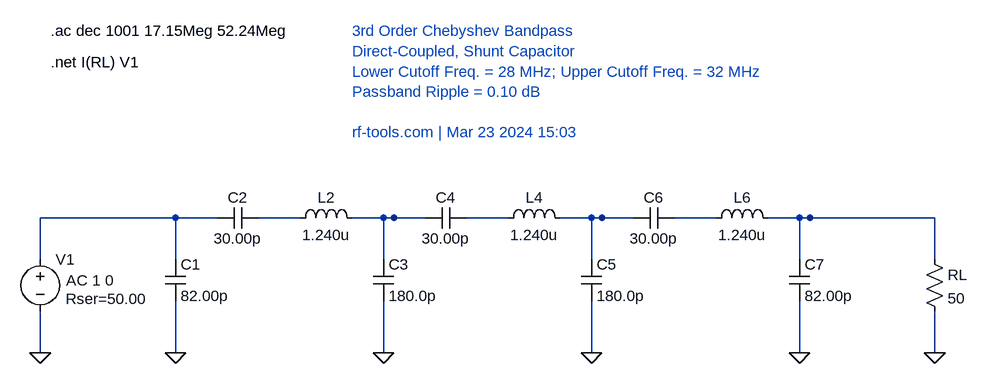
[diagram p0: schematic 10m.asc]
10m.asc, the LTspice schematic file:
Version 4
SHEET 1 1200 400
WIRE 0 0 0 64
WIRE 0 144 0 208
WIRE 0 0 208 0
WIRE 208 0 208 64
WIRE 208 128 208 208
WIRE 208 0 272 0
WIRE 336 0 400 0
WIRE 480 0 544 0
WIRE 528 0 528 64
WIRE 528 128 528 208
WIRE 528 0 592 0
WIRE 656 0 720 0
WIRE 800 0 864 0
WIRE 848 0 848 64
WIRE 848 128 848 208
WIRE 848 0 912 0
WIRE 976 0 1040 0
WIRE 1120 0 1184 0
WIRE 1168 0 1168 64
WIRE 1168 128 1168 208
WIRE 1168 0 1376 0
WIRE 1376 0 1376 64
WIRE 1376 144 1376 208
FLAG 0 208 0
FLAG 208 208 0
FLAG 528 208 0
FLAG 848 208 0
FLAG 1168 208 0
FLAG 1376 208 0
SYMBOL voltage 0 48 R0
WINDOW 123 40 48 Left 2
WINDOW 39 39 77 Left 2
SYMATTR InstName V1
SYMATTR Value ""
SYMATTR Value2 AC 1 0
SYMATTR SpiceLine Rser=50.00
SYMBOL cap 192 64 R0
SYMATTR InstName C1
SYMATTR Value 82.00p
SYMBOL cap 272 16 R270
SYMATTR InstName C2
SYMATTR Value 30.00p
WINDOW 0 32 32 VTop 2
WINDOW 3 0 32 VBottom 2
SYMBOL ind 384 16 R270
SYMATTR InstName L2
SYMATTR Value 1.240u
WINDOW 0 32 56 VTop 2
WINDOW 3 5 56 VBottom 2
SYMBOL cap 512 64 R0
SYMATTR InstName C3
SYMATTR Value 180.0p
SYMBOL cap 592 16 R270
SYMATTR InstName C4
SYMATTR Value 30.00p
WINDOW 0 32 32 VTop 2
WINDOW 3 0 32 VBottom 2
SYMBOL ind 704 16 R270
SYMATTR InstName L4
SYMATTR Value 1.240u
WINDOW 0 32 56 VTop 2
WINDOW 3 5 56 VBottom 2
SYMBOL cap 832 64 R0
SYMATTR InstName C5
SYMATTR Value 180.0p
SYMBOL cap 912 16 R270
SYMATTR InstName C6
SYMATTR Value 30.00p
WINDOW 0 32 32 VTop 2
WINDOW 3 0 32 VBottom 2
SYMBOL ind 1024 16 R270
SYMATTR InstName L6
SYMATTR Value 1.240u
WINDOW 0 32 56 VTop 2
WINDOW 3 5 56 VBottom 2
SYMBOL cap 1152 64 R0
SYMATTR InstName C7
SYMATTR Value 82.00p
SYMBOL res 1360 48 R0
SYMATTR InstName RL
SYMATTR Value 50
TEXT 16 -288 Left 2 !.ac dec 1001 17.15Meg 52.24Meg
TEXT 16 -240 Left 2 !.net I(RL) V1
TEXT 480 -288 Left 2 ;3rd Order Chebyshev Bandpass\nDirect-Coupled, Shunt Capacitor\nLower Cutoff Freq. = 28 MHz; Upper Cutoff Freq. = 32 MHz\nPassband Ripple = 0.10 dB\n\nrf-tools.com | Mar 23 2024 15:03

The netlist it stands for:
* 10m.asc
V1 N001 0 AC 1 0 Rser=50.00
C1 N001 0 82.00p
C2 N001 N002 30.00p
L2 N002 N003 1.240u
C3 N003 0 180.0p
C4 N003 N004 30.00p
L4 N004 N005 1.240u
C5 N005 0 180.0p
C6 N005 N006 30.00p
L6 N006 N007 1.240u
C7 N007 0 82.00p
RL N007 0 50
.ac dec 1001 17.15Meg 52.24Meg
.net I(RL) V1
* 3rd Order Chebyshev Bandpass
* Direct-Coupled, Shunt Capacitor
* Lower Cutoff Freq. = 28 MHz; Upper Cutoff Freq. = 32 MHz
* Passband Ripple = 0.10 dB
* rf-tools.com | Mar 23 2024 15:03
.backanno
.end